# Altium schematic sheet Clock_crosspoint.SchDoc
size A4; Organization: Altium Limited; Address1: L3, 12a Rodborough Rd; Address2: Frenchs Forest; Address3: NSW; Address4: Australia 2086
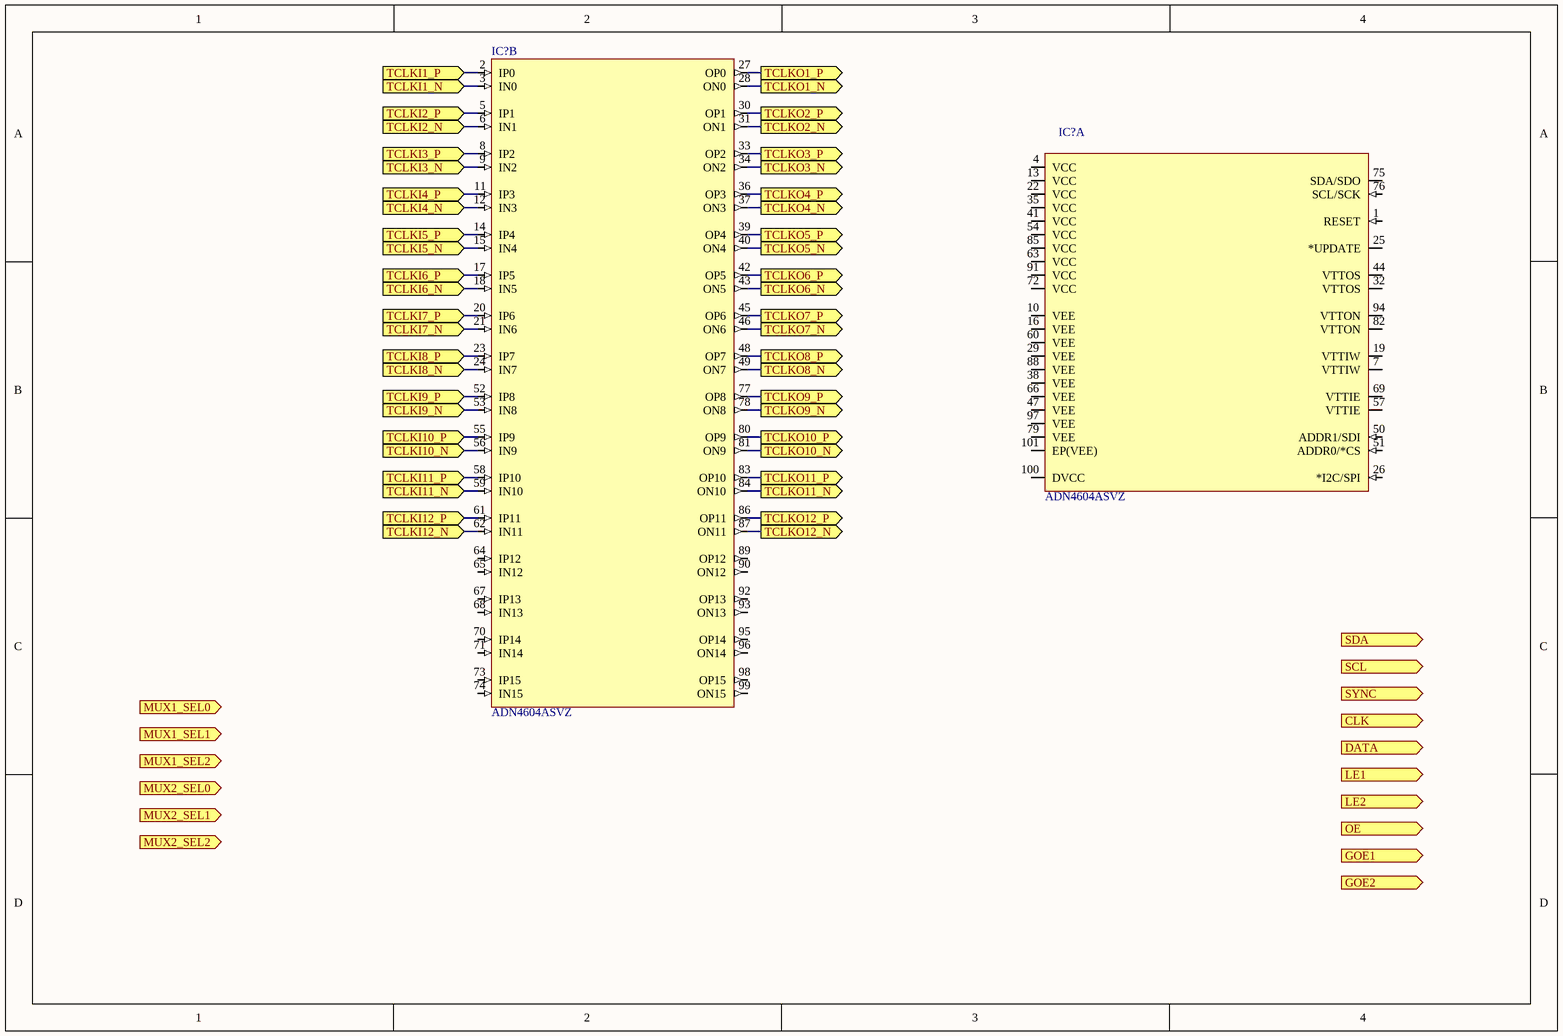
[diagram p0: Clock_crosspoint.SchDoc]

## Parts
(Parts that share a designator on the sheet are numbered #1, #2 ... from top to bottom, then left to right.)
IC?#1  ADN4604ASVZ  [TQFP100_TP]  (part A of 2)
IC?#2  ADN4604ASVZ  [TQFP100_TP]  (part B of 2)

## Ports
CLK (in), DATA (in), GOE1 (in), GOE2 (in), LE1 (in), LE2 (in), MUX1_SEL0 (in), MUX1_SEL1 (in), MUX1_SEL2 (in), MUX2_SEL0 (in), MUX2_SEL1 (in), MUX2_SEL2 (in), OE (in), SCL (in), SDA (in), SYNC (in), TCLKI1_N (in), TCLKI1_P (in), TCLKI2_N (in), TCLKI2_P (in), TCLKI3_N (in), TCLKI3_P (in), TCLKI4_N (in), TCLKI4_P (in), TCLKI5_N (in), TCLKI5_P (in), TCLKI6_N (in), TCLKI6_P (in), TCLKI7_N (in), TCLKI7_P (in), TCLKI8_N (in), TCLKI8_P (in), TCLKI9_N (in), TCLKI9_P (in), TCLKI10_N (in), TCLKI10_P (in), TCLKI11_N (in), TCLKI11_P (in), TCLKI12_N (in), TCLKI12_P (in), TCLKO1_N (out), TCLKO1_P (out), TCLKO2_N (out), TCLKO2_P (out), TCLKO3_N (out), TCLKO3_P (out), TCLKO4_N (out), TCLKO4_P (out), TCLKO5_N (out), TCLKO5_P (out), TCLKO6_N (out), TCLKO6_P (out), TCLKO7_N (out), TCLKO7_P (out), TCLKO8_N (out), TCLKO8_P (out), TCLKO9_N (out), TCLKO9_P (out), TCLKO10_N (out), TCLKO10_P (out), TCLKO11_N (out), TCLKO11_P (out), TCLKO12_N (out), TCLKO12_P (out)

## Nets
TCLKI1_N: IC?#2.3(IN0) ; port TCLKI1_N
TCLKI1_P: IC?#2.2(IP0) ; port TCLKI1_P
TCLKI2_N: IC?#2.6(IN1) ; port TCLKI2_N
TCLKI2_P: IC?#2.5(IP1) ; port TCLKI2_P
TCLKI3_N: IC?#2.9(IN2) ; port TCLKI3_N
TCLKI3_P: IC?#2.8(IP2) ; port TCLKI3_P
TCLKI4_N: IC?#2.12(IN3) ; port TCLKI4_N
TCLKI4_P: IC?#2.11(IP3) ; port TCLKI4_P
TCLKI5_N: IC?#2.15(IN4) ; port TCLKI5_N
TCLKI5_P: IC?#2.14(IP4) ; port TCLKI5_P
TCLKI6_N: IC?#2.18(IN5) ; port TCLKI6_N
TCLKI6_P: IC?#2.17(IP5) ; port TCLKI6_P
TCLKI7_N: IC?#2.21(IN6) ; port TCLKI7_N
TCLKI7_P: IC?#2.20(IP6) ; port TCLKI7_P
TCLKI8_N: IC?#2.24(IN7) ; port TCLKI8_N
TCLKI8_P: IC?#2.23(IP7) ; port TCLKI8_P
TCLKI9_N: IC?#2.53(IN8) ; port TCLKI9_N
TCLKI9_P: IC?#2.52(IP8) ; port TCLKI9_P
TCLKI10_N: IC?#2.56(IN9) ; port TCLKI10_N
TCLKI10_P: IC?#2.55(IP9) ; port TCLKI10_P
TCLKI11_N: IC?#2.59(IN10) ; port TCLKI11_N
TCLKI11_P: IC?#2.58(IP10) ; port TCLKI11_P
TCLKI12_N: IC?#2.62(IN11) ; port TCLKI12_N
TCLKI12_P: IC?#2.61(IP11) ; port TCLKI12_P
TCLKO1_N: IC?#2.28(ON0) ; port TCLKO1_N
TCLKO1_P: IC?#2.27(OP0) ; port TCLKO1_P
TCLKO2_N: IC?#2.31(ON1) ; port TCLKO2_N
TCLKO2_P: IC?#2.30(OP1) ; port TCLKO2_P
TCLKO3_N: IC?#2.34(ON2) ; port TCLKO3_N
TCLKO3_P: IC?#2.33(OP2) ; port TCLKO3_P
TCLKO4_N: IC?#2.37(ON3) ; port TCLKO4_N
TCLKO4_P: IC?#2.36(OP3) ; port TCLKO4_P
TCLKO5_N: IC?#2.40(ON4) ; port TCLKO5_N
TCLKO5_P: IC?#2.39(OP4) ; port TCLKO5_P
TCLKO6_N: IC?#2.43(ON5) ; port TCLKO6_N
TCLKO6_P: IC?#2.42(OP5) ; port TCLKO6_P
TCLKO7_N: IC?#2.46(ON6) ; port TCLKO7_N
TCLKO7_P: IC?#2.45(OP6) ; port TCLKO7_P
TCLKO8_N: IC?#2.49(ON7) ; port TCLKO8_N
TCLKO8_P: IC?#2.48(OP7) ; port TCLKO8_P
TCLKO9_N: IC?#2.78(ON8) ; port TCLKO9_N
TCLKO9_P: IC?#2.77(OP8) ; port TCLKO9_P
TCLKO10_N: IC?#2.81(ON9) ; port TCLKO10_N
TCLKO10_P: IC?#2.80(OP9) ; port TCLKO10_P
TCLKO11_N: IC?#2.84(ON10) ; port TCLKO11_N
TCLKO11_P: IC?#2.83(OP10) ; port TCLKO11_P
TCLKO12_N: IC?#2.87(ON11) ; port TCLKO12_N
TCLKO12_P: IC?#2.86(OP11) ; port TCLKO12_P

Not connected (* = marked no-connect by the designer): IC?#1 1(RESET) 4(VCC) 7(VTTIW) 10(VEE) 13(VCC) 16(VEE) 19(VTTIW) 22(VCC) 25(*UPDATE) 26(*I2C/SPI) 29(VEE) 32(VTTOS) 35(VCC) 38(VEE) 41(VCC) 44(VTTOS) 47(VEE) 50(ADDR1/SDI) 51(ADDR0/*CS) 54(VCC) 57(VTTIE) 60(VEE) 63(VCC) 66(VEE) 69(VTTIE) 72(VCC) 75(SDA/SDO) 76(SCL/SCK) 79(VEE) 82(VTTON) 85(VCC) 88(VEE) 91(VCC) 94(VTTON) 97(VEE) 100(DVCC) 101(EP(VEE)); IC?#2 64(IP12) 65(IN12) 67(IP13) 68(IN13) 70(IP14) 71(IN14) 73(IP15) 74(IN15) 89(OP12) 90(ON12) 92(OP13) 93(ON13) 95(OP14) 96(ON14) 98(OP15) 99(ON15)

## Library data of the parts
IC?#1 IC?#2 = IFC_ADN4604ASVZ: 16x16 CML crosspoint switch; RefDes: RefDes; Type: DEV; Value: Value